# Altium schematic sheet Wireless_thermometer_sensors.SchDoc
size A3; SheetNumber: 2; SheetTotal: 2
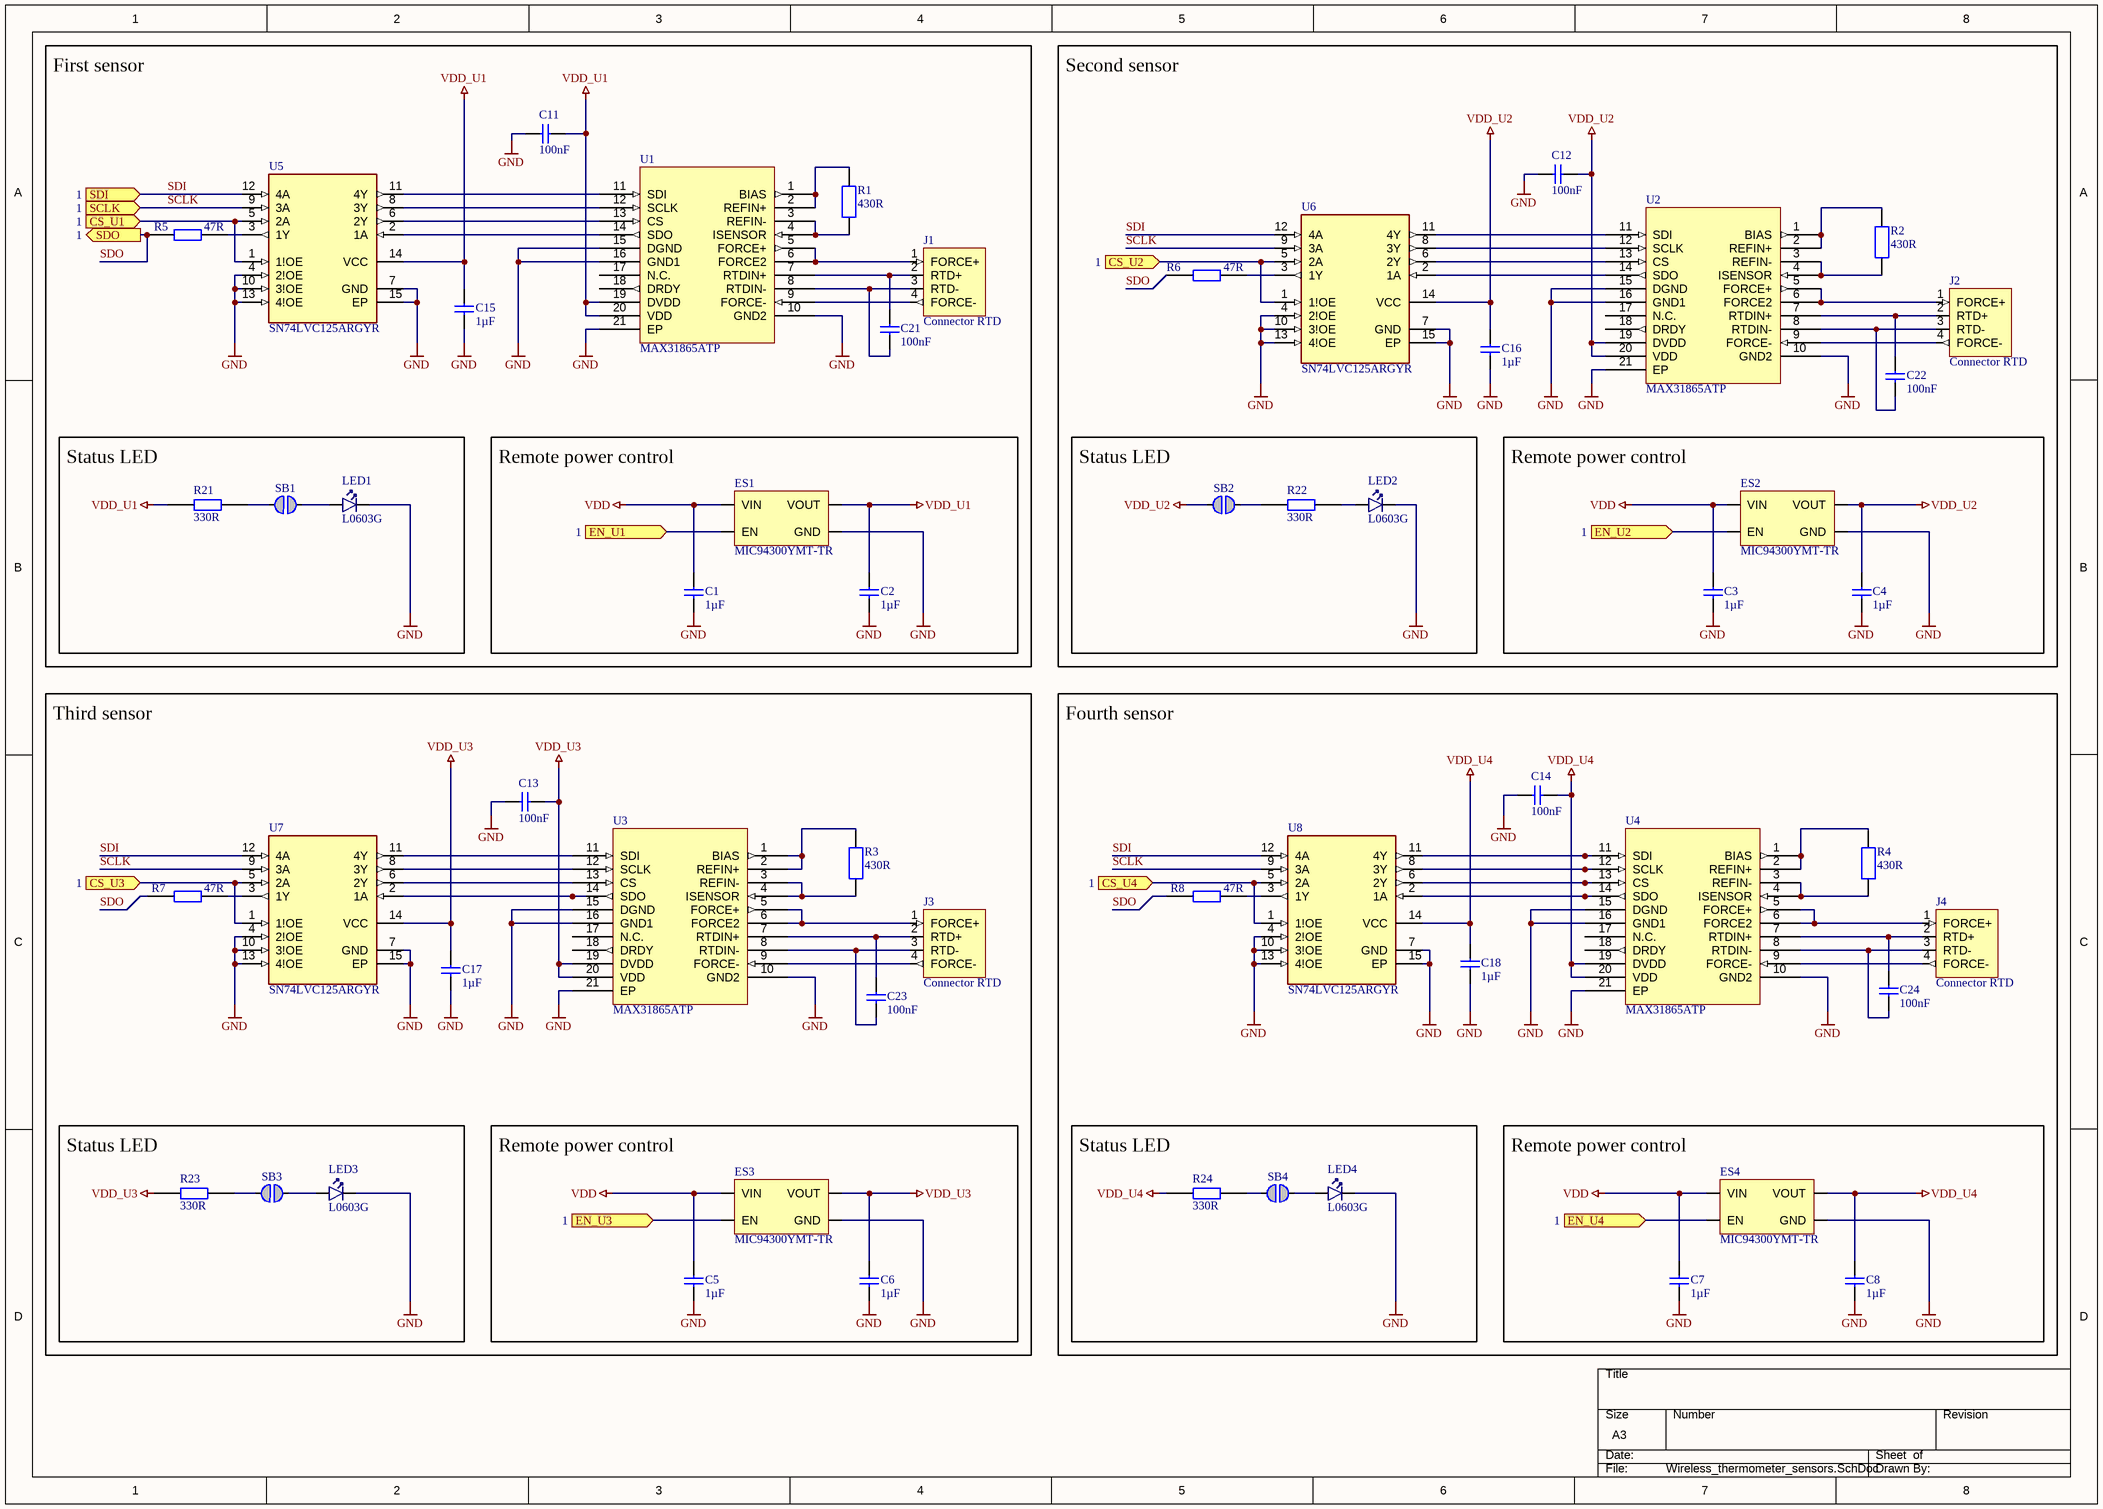
[diagram p0: Wireless_thermometer_sensors.SchDoc]

## Parts
C1  1µF  [CAPC1005X04L]
C2  1µF  [CAPC1005X04L]
C3  1µF  [CAPC1005X04L]
C4  1µF  [CAPC1005X04L]
C5  1µF  [CAPC1005X04L]
C6  1µF  [CAPC1005X04L]
C7  1µF  [CAPC1005X04L]
C8  1µF  [CAPC1005X04L]
C11  100nF  [CAPC1005X04L]
C12  100nF  [CAPC1005X04L]
C13  100nF  [CAPC1005X04L]
C14  100nF  [CAPC1005X04L]
C15  1µF  [CAPC1005X04L]
C16  1µF  [CAPC1005X04L]
C17  1µF  [CAPC1005X04L]
C18  1µF  [CAPC1005X04L]
C21  100nF  [CAPC1005X04L]
C22  100nF  [CAPC1005X04L]
C23  100nF  [CAPC1005X04L]
C24  100nF  [CAPC1005X04L]
ES1  MIC94300YMT-TR  [MIC94300YMT-TR]
ES2  MIC94300YMT-TR  [MIC94300YMT-TR]
ES3  MIC94300YMT-TR  [MIC94300YMT-TR]
ES4  MIC94300YMT-TR  [MIC94300YMT-TR]
J1  Connector RTD  [CON-RTD]
J2  Connector RTD  [CON-RTD]
J3  Connector RTD  [CON-RTD]
J4  Connector RTD  [CON-RTD]
LED1  L0603G  [LED_0603_G]
LED2  L0603G  [LED_0603_G]
LED3  L0603G  [LED_0603_G]
LED4  L0603G  [LED_0603_G]
R1  430R  [RESR1608X06]
R2  430R  [RESR1608X06]
R3  430R  [RESR1608X06]
R4  430R  [RESR1608X06]
R5  47R  [RESC1005X04L]
R6  47R  [RESC1005X04L]
R7  47R  [RESC1005X04L]
R8  47R  [RESC1005X04L]
R21  330R  [RESC1005X04L]
R22  330R  [RESC1005X04L]
R23  330R  [RESC1005X04L]
R24  330R  [RESC1005X04L]
SB1  Solderbridge  [Solderbridge]  (value not drawn)  (no BOM)
SB2  Solderbridge  [Solderbridge]  (value not drawn)  (no BOM)
SB3  Solderbridge  [Solderbridge]  (value not drawn)  (no BOM)
SB4  Solderbridge  [Solderbridge]  (value not drawn)  (no BOM)
U1  MAX31865ATP  [21-0140L_T2055-5_MXM-L]
U2  MAX31865ATP  [21-0140L_T2055-5_MXM-L]
U3  MAX31865ATP  [21-0140L_T2055-5_MXM-L]
U4  MAX31865ATP  [21-0140L_T2055-5_MXM-L]
U5  SN74LVC125ARGYR  [QFN50P350X350X100-15N]
U6  SN74LVC125ARGYR  [QFN50P350X350X100-15N]
U7  SN74LVC125ARGYR  [QFN50P350X350X100-15N]
U8  SN74LVC125ARGYR  [QFN50P350X350X100-15N]

## Ports
CS_U1 (in, see 1), CS_U2 (in, see 1), CS_U3 (in, see 1), CS_U4 (in, see 1), EN_U1 (in, see 1), EN_U2 (in, see 1), EN_U3 (in, see 1), EN_U4 (in, see 1), SCLK (in, see 1), SDI (in, see 1), SDO (out, see 1)

## Nets
GND: C1.1 C2.1 C3.1 C4.1 C5.1 C6.1 C7.1 C8.1 C11.1 C12.1 C13.2 C14.1 C15.1 C16.1 C17.1 C18.1 ES1.2(GND) ES2.2(GND) ES3.2(GND) ES4.2(GND) LED1.1(C) LED2.1(C) LED3.1(C) LED4.1(C) U1.10(GND2) U1.15(DGND) U1.16(GND1) U1.21(EP) U2.10(GND2) U2.15(DGND) U2.16(GND1) U2.21(EP) U3.10(GND2) U3.15(DGND) U3.16(GND1) U3.21(EP) U4.10(GND2) U4.15(DGND) U4.16(GND1) U4.21(EP) U5.4(2!OE) U5.7(GND) U5.10(3!OE) U5.13(4!OE) U5.15(EP) U6.4(2!OE) U6.7(GND) U6.10(3!OE) U6.13(4!OE) U6.15(EP) U7.4(2!OE) U7.7(GND) U7.10(3!OE) U7.13(4!OE) U7.15(EP) U8.4(2!OE) U8.7(GND) U8.10(3!OE) U8.13(4!OE) U8.15(EP)
VDD: C1.2 C3.2 C5.2 C7.2 ES1.4(VIN) ES2.4(VIN) ES3.4(VIN) ES4.4(VIN)
VDD_U1: C2.2 C11.2 C15.2 ES1.3(VOUT) R21.1 U1.19(DVDD) U1.20(VDD) U5.14(VCC)
VDD_U2: C4.2 C12.2 C16.2 ES2.3(VOUT) SB2.2 U2.19(DVDD) U2.20(VDD) U6.14(VCC)
VDD_U3: C6.2 C13.1 C17.2 ES3.3(VOUT) R23.1 U3.19(DVDD) U3.20(VDD) U7.14(VCC)
VDD_U4: C8.2 C14.2 C18.2 ES4.3(VOUT) R24.1 U4.19(DVDD) U4.20(VDD) U8.14(VCC)
CS_U1: U5.1(1!OE) U5.5(2A) ; port CS_U1
CS_U2: U6.1(1!OE) U6.5(2A) ; port CS_U2
CS_U3: U7.1(1!OE) U7.5(2A) ; port CS_U3
CS_U4: U8.1(1!OE) U8.5(2A) ; port CS_U4
EN_U1: ES1.1(EN) ; port EN_U1
EN_U2: ES2.1(EN) ; port EN_U2
EN_U3: ES3.1(EN) ; port EN_U3
EN_U4: ES4.1(EN) ; port EN_U4
SCLK: U5.9(3A) U6.9(3A) U7.9(3A) U8.9(3A) ; port SCLK
SDI: U5.12(4A) U6.12(4A) U7.12(4A) U8.12(4A) ; port SDI
SDO: R5.1 R6.1 R7.1 R8.1 ; port SDO
NetC21_1: C21.1 J1.3(RTD-) U1.8(RTDIN-)
NetC21_2: C21.2 J1.2(RTD+) U1.7(RTDIN+)
NetC22_1: C22.1 J2.3(RTD-) U2.8(RTDIN-)
NetC22_2: C22.2 J2.2(RTD+) U2.7(RTDIN+)
NetC23_1: C23.1 J3.3(RTD-) U3.8(RTDIN-)
NetC23_2: C23.2 J3.2(RTD+) U3.7(RTDIN+)
NetC24_1: C24.1 J4.3(RTD-) U4.8(RTDIN-)
NetC24_2: C24.2 J4.2(RTD+) U4.7(RTDIN+)
NetJ1_1: J1.1(FORCE+) U1.5(FORCE+) U1.6(FORCE2)
NetJ1_4: J1.4(FORCE-) U1.9(FORCE-)
NetJ2_1: J2.1(FORCE+) U2.5(FORCE+) U2.6(FORCE2)
NetJ2_4: J2.4(FORCE-) U2.9(FORCE-)
NetJ3_1: J3.1(FORCE+) U3.5(FORCE+) U3.6(FORCE2)
NetJ3_4: J3.4(FORCE-) U3.9(FORCE-)
NetJ4_1: J4.1(FORCE+) U4.5(FORCE+) U4.6(FORCE2)
NetJ4_4: J4.4(FORCE-) U4.9(FORCE-)
NetLED1_2: LED1.2(A) SB1.1
NetLED2_2: LED2.2(A) R22.2
NetLED3_2: LED3.2(A) SB3.1
NetLED4_2: LED4.2(A) SB4.1
NetR1_1: R1.1 U1.3(REFIN-) U1.4(ISENSOR)
NetR1_2: R1.2 U1.1(BIAS) U1.2(REFIN+)
NetR2_1: R2.1 U2.3(REFIN-) U2.4(ISENSOR)
NetR2_2: R2.2 U2.1(BIAS) U2.2(REFIN+)
NetR3_1: R3.1 U3.3(REFIN-) U3.4(ISENSOR)
NetR3_2: R3.2 U3.1(BIAS) U3.2(REFIN+)
NetR4_1: R4.1 U4.3(REFIN-) U4.4(ISENSOR)
NetR4_2: R4.2 U4.1(BIAS) U4.2(REFIN+)
NetR5_2: R5.2 U5.3(1Y)
NetR6_2: R6.2 U6.3(1Y)
NetR7_2: R7.2 U7.3(1Y)
NetR8_2: R8.2 U8.3(1Y)
NetR21_2: R21.2 SB1.2
NetR22_1: R22.1 SB2.1
NetR23_2: R23.2 SB3.2
NetR24_2: R24.2 SB4.2
NetU1_11: U1.11(SDI) U5.11(4Y)
NetU1_12: U1.12(SCLK) U5.8(3Y)
NetU1_13: U1.13(CS) U5.6(2Y)
NetU1_14: U1.14(SDO) U5.2(1A)
NetU2_11: U2.11(SDI) U6.11(4Y)
NetU2_12: U2.12(SCLK) U6.8(3Y)
NetU2_13: U2.13(CS) U6.6(2Y)
NetU2_14: U2.14(SDO) U6.2(1A)
NetU3_11: U3.11(SDI) U7.11(4Y)
NetU3_12: U3.12(SCLK) U7.8(3Y)
NetU3_13: U3.13(CS) U7.6(2Y)
NetU3_14: U3.14(SDO) U7.2(1A)
NetU4_11: U4.11(SDI) U8.11(4Y)
NetU4_12: U4.12(SCLK) U8.8(3Y)
NetU4_13: U4.13(CS) U8.6(2Y)
NetU4_14: U4.14(SDO) U8.2(1A)

Not connected (* = marked no-connect by the designer): U1 17(N.C.) 18(DRDY); U2 17(N.C.) 18(DRDY); U3 17(N.C.) 18(DRDY); U4 17(N.C.) 18(DRDY)

## Notes on the sheet
- Status LED
- Remote power control
- First sensor
- Second sensor
- Third sensor
- Fourth sensor

## Library data of the parts
C1-C8 C11-C18 C21-C24 = CAP_0402: Capacitor, X7R, ±10%; Part Number: C0402-1µ0; LatestRevisionDate: 2016-08-22; Pin Count: 2; Publisher: Nordic Semiconductor; Published: 2009-05-08; Footprint Doc: 0402
  C1-C8 C15-C18: Value: 1µF
  C11-C14 C21-C24: Value: 100nF
ES1-ES4 = MIC94300YMT-TR: MIC94300 Series Single 3.6 V 200 mA Ripple Blocker Technology Load Switch -MLF-4; Manufacturer: Microchip; Number of Outputs: 1; Output Current: 200mA; Interface: On/Off; Output Configuration: High Side; Turn-On Delay Time: 150us; Max Supply Current: 1uA; Fault Protection: Over Temperature; Operating Supply Voltage: 3.6V; Supplier 1: Digi-Key; Manufacturer Part Number: MIC94300YMT-TR; RoHS: Yes; Category: Hot Swap Controllers; Stock 1: 47472; Pricing 1: 1=0,34000, 25=0,30000 (USD); Mount: Surface Mount; Number of Pins: 4; Min Operating Temperature: -40°C; Max Operating Temperature: 125°C; Packaging: Tape and Reel; Package Quantity: 5000; Max Output Current: 200mA; Series: Ripple Blocker™; Current Rating: 200mA; Rated Current-Max: 200mA; Radiation Hardening: No; RoHS Compliant: Yes; Lead Free: Lead Free; REACH SVHC: No SVHC; ComponentLink1URL: https://datasheet.ciiva.com/1957/mic94300-1957169.pdf?src-supplier=Digi-Key; ComponentLink1Description: https://datasheet.ciiva.com/1957/mic94300-1957169.pdf?src-supplier=Digi-Key; ComponentLink2URL: https://datasheet.ciiva.com/22629/1563190-22629143.pdf?src-supplier=Element14; ComponentLink2Description: https://datasheet.ciiva.com/22629/1563190-22629143.pdf?src-supplier=Element14; ComponentLink3URL: https://datasheet.ciiva.com/1955/mic94300-1955787.pdf?src-supplier=Digi-Key; ComponentLink3Description: https://datasheet.ciiva.com/1955/mic94300-1955787.pdf?src-supplier=Digi-Key; ComponentLink4URL: https://datasheet.ciiva.com/1956/mic94300-1956219.pdf?src-supplier=Digi-Key; ComponentLink4Description: https://datasheet.ciiva.com/1956/mic94300-1956219.pdf?src-supplier=Digi-Key; ComponentLink5URL: https://datasheet.ciiva.com/15200/getdatasheetpartid-478360-15200797.pdf?src-supplier=Verical; ComponentLink5Description: https://datasheet.ciiva.com/15200/getdatasheetpartid-478360-15200797.pdf?src-supplier=Verical; Supplier Part Number 1: 576-4011-1-ND
J1-J4 = CON-RTD
LED1-LED4 = D:LED: LED, Green, 0603, 573nm, Vf=2.0V, 24mcd, - 40 to +85°C; Part Number: VS 25C7M5; Manufacturer: Victory Electronics; Part number IPS: N.A.; Artikkelnr Noca: 13019193; Manufacturer Part Number: VS 25C7M5; Footprint Doc: 0603; LatestRevisionDate: 2017-08-21; Pin Count: 2; Publisher: Nordic Semiconductor; Published: 2017-08-21; Value: L0603G; Note: *; ComponentLink1URL: *; ComponentLink1Description: Datasheet; ComponentLink2URL: *; ComponentLink2Description: Supplier link; HelpURL: \\hizz\pro\app9717\Datasheet\optoelectronics\Victory Electronics\VS 25C7M5.pdf; Supplier 1: EC Partner; Supplier Part Number 1: *; Supplier 2: *; Supplier Part Number 2: *
R1-R4 = RES_0603: Resistor; Part Number: R0603-430R; LatestRevisionDate: 2015-06-10; Pin Count: 2; Publisher: Nordic Semiconductor; Published: 2015-06-10; Value: 430R; Footprint Doc: 0603
R5-R8 = RES_0402: Resistor; Part Number: R0603-430R; Value: 430R; LatestRevisionDate: 2015-06-10; Pin Count: 2; Publisher: Nordic Semiconductor; Published: 2015-06-10; Footprint Doc: 0603
R21-R24 = RES_0402: Resistor; Part Number: R0603-430R; LatestRevisionDate: 2015-06-10; Pin Count: 2; Publisher: Nordic Semiconductor; Published: 2015-06-10; Value: 330R; Footprint Doc: 0603
SB1-SB4 = SOLDERBRIDGE: Artikkelnr Noca: N.A.; Part Number: Solderbridge; Manufacturer: *; Manufacturer Part Number: *; LatestRevisionDate: 2009-12-14; Pin Count: 2; Publisher: Nordic Semiconductor; Published: 2009-12-14; Value: Solderbridge; Note: *; Footprint Doc: Solderbridge; Part number IPS: N.A.; ComponentLink1URL: *; ComponentLink1Description: Datasheet; ComponentLink2URL: *; ComponentLink2Description: Supplier link; HelpURL: *; Supplier 1: *; Supplier Part Number 1: *; Supplier 2: *; Supplier Part Number 2: *
U1-U4 = MAX31865ATP: Circuit Protection Misc Resistance Temperature Detector to Digital Converter; Manufacturer: Maxim; Manufacturer Part Number: MAX31865ATP+T; Interface: SPI; Supplier 1: Future Electronics; RoHS: Yes; Category: Power Management ICs; Pricing 1: 2500=4,42000 (USD); Case/Package: QFN; Number of Pins: 20; Min Operating Temperature: -40°C; Max Operating Temperature: 125°C; Packaging: Tape and Reel; Package Quantity: 2500; Output Type: SPI; Series: -; Radiation Hardening: No; RoHS Compliant: Yes; ComponentLink1URL: https://datasheet.ciiva.com/14320/max31865-14320743.pdf?src-supplier=Avnet; ComponentLink1Description: https://datasheet.ciiva.com/14320/max31865-14320743.pdf?src-supplier=Avnet; ComponentLink2URL: https://datasheet.ciiva.com/25893/max31865-25893916.pdf?src-supplier=Avnet+Europe; ComponentLink2Description: https://datasheet.ciiva.com/25893/max31865-25893916.pdf?src-supplier=Avnet+Europe; ComponentLink3URL: https://datasheet.ciiva.com/14083/max31865-14083679.pdf?src-supplier=Digi-Key; ComponentLink3Description: https://datasheet.ciiva.com/14083/max31865-14083679.pdf?src-supplier=Digi-Key; Supplier Part Number 1: 9084949
U5-U8 = SN74LVC125ARGYR: Quadruple Bus Buffer Gate With 3-State Outputs 14-VQFN -40 to 125; Value: *; Availability: Unavailable; Package: None; MP: SN74LVC125ARGYR; Price: None